# EAGLE design SulaMatik (EAGLE 6.4)
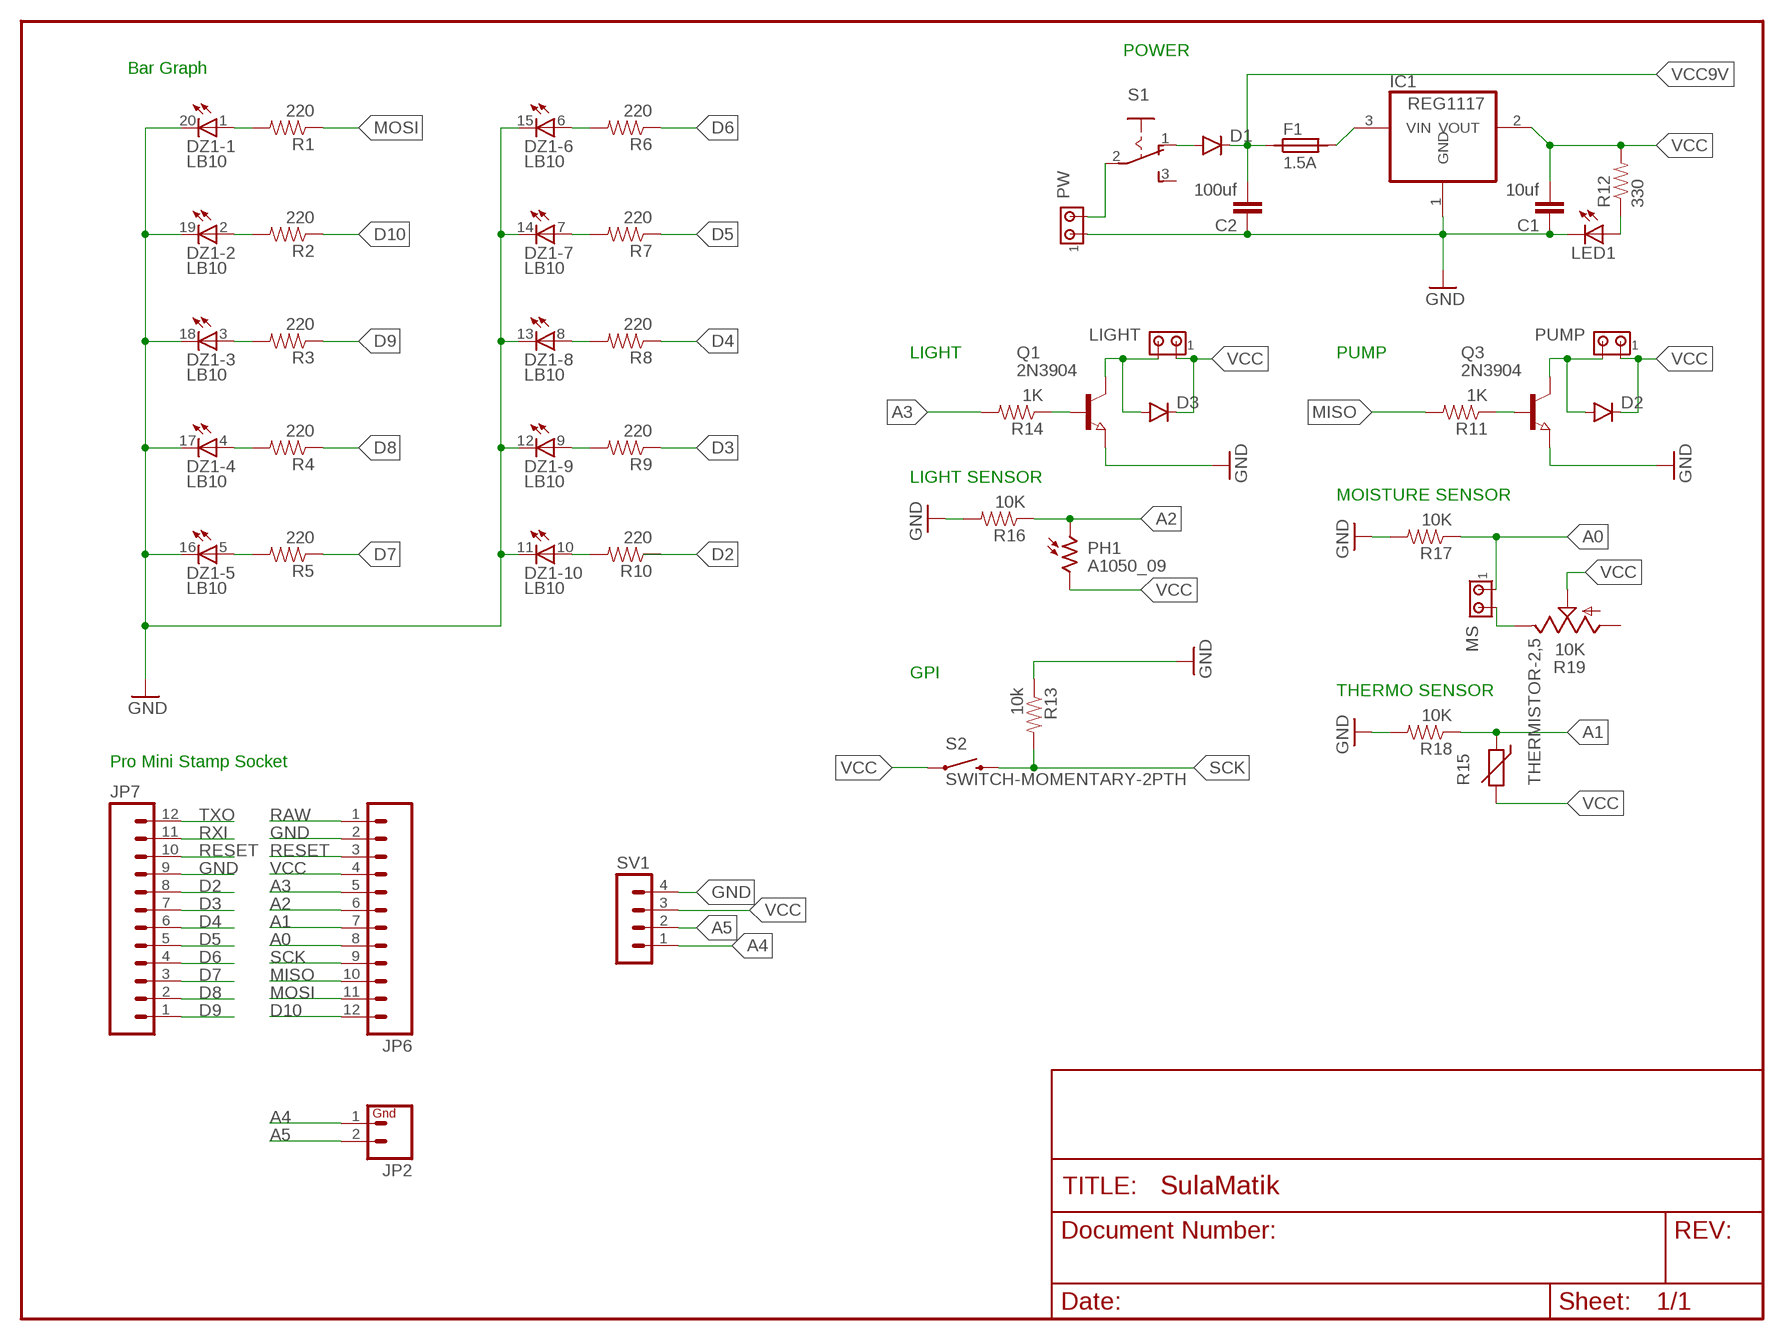
[diagram p0: schematic, sheet 1]

## Parts
C1  10uf  CAP0805  [0805]
C2  100uf  CAP0805  [0805]
D1  DIODESMA  [SMA-DIODE]
D2  DIODESMA  [SMA-DIODE]
D3  DIODESMA  [SMA-DIODE]
DZ1  LB10  [LB10]
F1  1.5A  SIBA194600  [1820]
IC1  REG1117  [SOT223]
JP2  M02PTH  [1X02]
JP6  M12PTH  [1X12]
JP7  M12PTH  [1X12]
LED1  LEDCHIP-LED0805  [CHIP-LED0805]
LIGHT  MTA02-156  [1X2MTA]
MS  MTA02-156  [1X2MTA]
PH1  A1050_09  [T0-46-A10XX]
PUMP  MTA02-156  [1X2MTA]
PW  MTA02-156  [1X2MTA]
Q1  2N3904  NPN-TRANSISTOR_SOT23  [SOT23]
Q3  2N3904  NPN-TRANSISTOR_SOT23  [SOT23]
R1  220  RESISTOR0805-RES  [0805]
R2  220  RESISTOR0805-RES  [0805]
R3  220  RESISTOR0805-RES  [0805]
R4  220  RESISTOR0805-RES  [0805]
R5  220  RESISTOR0805-RES  [0805]
R6  220  RESISTOR0805-RES  [0805]
R7  220  RESISTOR0805-RES  [0805]
R8  220  RESISTOR0805-RES  [0805]
R9  220  RESISTOR0805-RES  [0805]
R10  220  RESISTOR0805-RES  [0805]
R11  1K  RESISTOR0805-RES  [0805]
R12  330  RESISTOR0805-RES  [0805]
R13  10k  RESISTOR0805-RES  [0805]
R14  1K  RESISTOR0805-RES  [0805]
R15  THERMISTOR-2,5  [RS-2,5]
R16  10K  RESISTOR0805-RES  [0805]
R17  10K  RESISTOR0805-RES  [0805]
R18  10K  RESISTOR0805-RES  [0805]
R19  10K  TRIM_US-CA6V  [CA6V]
S1  255SB  [255SB]
S2  SWITCH-MOMENTARY-2PTH  [TACTILE-PTH]
SV1  MA04-1  [MA04-1]

## Nets
A0: JP6.8 MS.1 R17.1
A1: JP6.7 R15.1 R18.1
A2: JP6.6 PH1.1 R16.1
A3: JP6.5 R14.2
A4: JP2.1 SV1.1
A5: JP2.2 SV1.2
D2: JP7.8 R10.1
D3: JP7.7 R9.1
D4: JP7.6 R8.1
D5: JP7.5 R7.1
D6: JP7.4 R6.1
D7: JP7.3 R5.1
D8: JP7.2 R4.1
D9: JP7.1 R3.1
D10: JP6.12 R2.1
GND: C1.1 C2.1 DZ1.11(-10:C) DZ1.12(-9:C) DZ1.13(-8:C) DZ1.14(-7:C) DZ1.15(-6:C) DZ1.16(-5:C) DZ1.17(-4:C) DZ1.18(-3:C) DZ1.19(-2:C) DZ1.20(-1:C) IC1.1(GND) JP6.2 JP7.9 LED1.C PW.1 Q1.2(E) Q3.2(E) R13.1 R16.2 R17.2 R18.2 SV1.4
MISO: JP6.10 R11.2
MOSI: JP6.11 R1.1
N$1: F1.2 IC1.3(VIN)
N$2: PW.2 S1.2(P)
N$3: DZ1.5(-5:A) R5.2
N$4: DZ1.4(-4:A) R4.2
N$5: D2.A PUMP.2 Q3.3(C)
N$6: Q3.1(B) R11.1
N$7: DZ1.3(-3:A) R3.2
N$8: DZ1.2(-2:A) R2.2
N$9: DZ1.1(-1:A) R1.2
N$10: DZ1.6(-6:A) R6.2
N$11: LED1.A R12.1
N$12: DZ1.7(-7:A) R7.2
N$13: D1.A S1.1(O)
N$14: DZ1.8(-8:A) R8.2
N$15: DZ1.9(-9:A) R9.2
N$16: DZ1.10(-10:A) R10.2
N$17: MS.2 R19.E
N$19: D3.A LIGHT.2 Q1.3(C)
N$20: Q1.1(B) R14.1
RAW [v]: JP6.1
RESET: JP6.3 JP7.10
RXI: JP7.11
SCK: JP6.9 R13.2 S2.3
TXO: JP7.12
VCC: C1.2 D2.C D3.C IC1.2(VOUT) JP6.4 LIGHT.1 PH1.2 PUMP.1 R12.2 R15.2 R19.S S2.1 SV1.3
VCC9V: C2.2 D1.C F1.1
Unconnected: R19.A S1.3(S)

## Notes on the sheet
- POWER
- Bar Graph
- LIGHT | PUMP
- LIGHT SENSOR
- MOISTURE SENSOR
- GPI
- THERMO SENSOR
- Pro Mini Stamp Socket

## Library data of the parts
C1 C2 = SparkFun-Capacitors:CAP: Capacitor Standard 0603 ceramic capacitor, and 0.1" leaded capacitor.
D1-D3 = SparkFun-DiscreteSemi:DIODE: Diode These are standard reverse protection diodes and small signal diodes. SMA package can handle up to about 1A. SOD-323 can handle about 200mA. What the SOD-323 package when ordering, there are some mfgs out there that are 5-pin packages.
DZ1 = led:LB10: LED BLOCK 10-LED bar graph, DIL, Siemens
F1 = _hhn_PtcFuses_Siba_r500_Ozan:SIBA194600*: SIBA PTC-Fuses, Series 194600, 1812 (4.5 3.2)mm Source: www.siba.de/ Package: SMD 1812 (4.5 x 3.2)mm Technologies: SIBA194600Axxx xxx: Trip-Current * 10 mA Author: Dipl.-Ing. FH Rainer Bayer
IC1 = burr-brown:REG1117: 800mA and 1A Low Dropout (LDO) Positive Regulator 1.8V, 2.5V, 2.85V, 3.3V, 5V, and Adj; MPN: REG1117; OC_FARNELL: 1097566; OC_NEWARK: 14P6981
JP2 = SparkFun:M02: Header 2 Standard 2-pin 0.1" header. Use with straight break away headers (SKU : PRT-00116), right angle break away headers (PRT-00553), swiss pins (PRT-00743), machine pins (PRT-00117), and female headers (PRT-00115). Molex polarized connector foot print use with SKU : PRT-08233 with associated crimp pins and housings.
JP6 JP7 = SparkFun:M12: Header 12 Standard 12-pin 0.1" header. Use with straight break away headers (SKU : PRT-00116), right angle break away headers (PRT-00553), swiss pins (PRT-00743), machine pins (PRT-00117), and female headers (PRT-00115).
LED1 = led:LED: LED OSRAM: - CHIPLED LG R971, LG N971, LY N971, LG Q971, LY Q971, LO R971, LY R971 LH N974, LH R974 LS Q976, LO Q976, LY Q976 LO Q996 - Hyper CHIPLED LW Q18S LB Q993, LB Q99A, LB R99A - SideLED LS A670, LO A670, LY A670, LG A670, LP A670 LB A673, LV A673, LT A673, LW A673 LH A674 LY A675 LS A676, LA A676, LO A676, LY A676, LW A676 LS A679, LY A679, LG A679 - Hyper Micro SIDELED® LS Y876, LA Y876, LO Y876, LY Y876 LT Y87S - SmartLED LW L88C, LW L88S LB L89C, LB L89S, LG L890 LS L89K, LO L89K, LY L89K LS L896, LA L896, LO L896, LY L896 - TOPLED LS T670, LO T670, LY T670, LG T670, LP T670 LSG T670, LSP T670, LSY T670, LOP T670, LYG T670 LG T671, LOG T671, LSG T671 LB T673, LV T673, LT T673, LW T673 LH T674 LS T676, LA T676, LO T676, LY T676, LB T676, LH T676, LSB T676, LW T676 LB T67C, LV T67C, LT T67C, LS T67K, LO T67K, LY T67K, LW E67C LS E67B, LA E67B, LO E67B, LY E67B, LB E67C, LV E67C, LT E67C LW T67C LS T679, LY T679, LG T679 LS T770, LO T770, LY T770, LG T770, LP T770 LB T773, LV T773, LT T773, LW T773 LH T774 LS E675, LA E675, LY E675, LS T675 LS T776, LA T776, LO T776, LY T776, LB T776 LHGB T686 LT T68C, LB T68C - Hyper Mini TOPLED® LB M676 - Mini TOPLED Santana® LG M470 LS M47K, LO M47K, LY M47K Source: http://www.osram.convergy.de LUXEON: - LUMILED® LXK2-PW12-R00, LXK2-PW12-S00, LXK2-PW14-U00, LXK2-PW14-V00 LXK2-PM12-R00, LXK2-PM12-S00, LXK2-PM14-U00 LXK2-PE12-Q00, LXK2-PE12-R00, LXK2-PE12-S00, LXK2-PE14-T00, LXK2-PE14-U00 LXK2-PB12-K00, LXK2-PB12-L00, LXK2-PB12-M00, LXK2-PB14-N00, LXK2-PB14-P00, LXK2-PB14-Q00 LXK2-PR12-L00, LXK2-PR12-M00, LXK2-PR14-Q00, LXK2-PR14-R00 LXK2-PD12-Q00, LXK2-PD12-R00, LXK2-PD12-S00 LXK2-PH12-R00, LXK2-PH12-S00 LXK2-PL12-P00, LXK2-PL12-Q00, LXK2-PL12-R00 Source: www.luxeon.com KINGBRIGHT: KA-3528ASYC Source: www.kingbright.com
LIGHT MS PUMP PW = con-amp:MTA02-156: AMP connector
PH1 = photo-elements:A10: Sensor Robust Light Sensing Applications Outdoor Light Sensing Application Source: http://optoelectronics.perkinelmer.com/content/Datasheets/DTS_PhotocellsA1050.pdf
Q1 Q3 = semicon-smd-ipc:NPN-TRANSISTOR_: NPN TRANSISTOR
R1-R14 R16-R18 = SparkFun-Passives:RESISTOR: Resistor Basic schematic elements and footprints for 0603, 1206, and PTH resistors.
R15 = varistor:THERMISTOR: THERMISTOR
R19 = pot:TRIM_US-: POTENTIOMETER
S1 = switch:255SB: SLIDING SWITCH Distributor Buerklin, 11G810
S2 = SparkFun-Electromechanical:SWITCH-MOMENTARY-2: Various NO switches- pushbuttons, reed, etc
SV1 = con-lstb:MA04-1: PIN HEADER; OC_FARNELL: unknown; OC_NEWARK: unknown

## Net classes
0 default: width 0.3 mm, drill 0.5 mm, clearance 0.25 mm

## Board
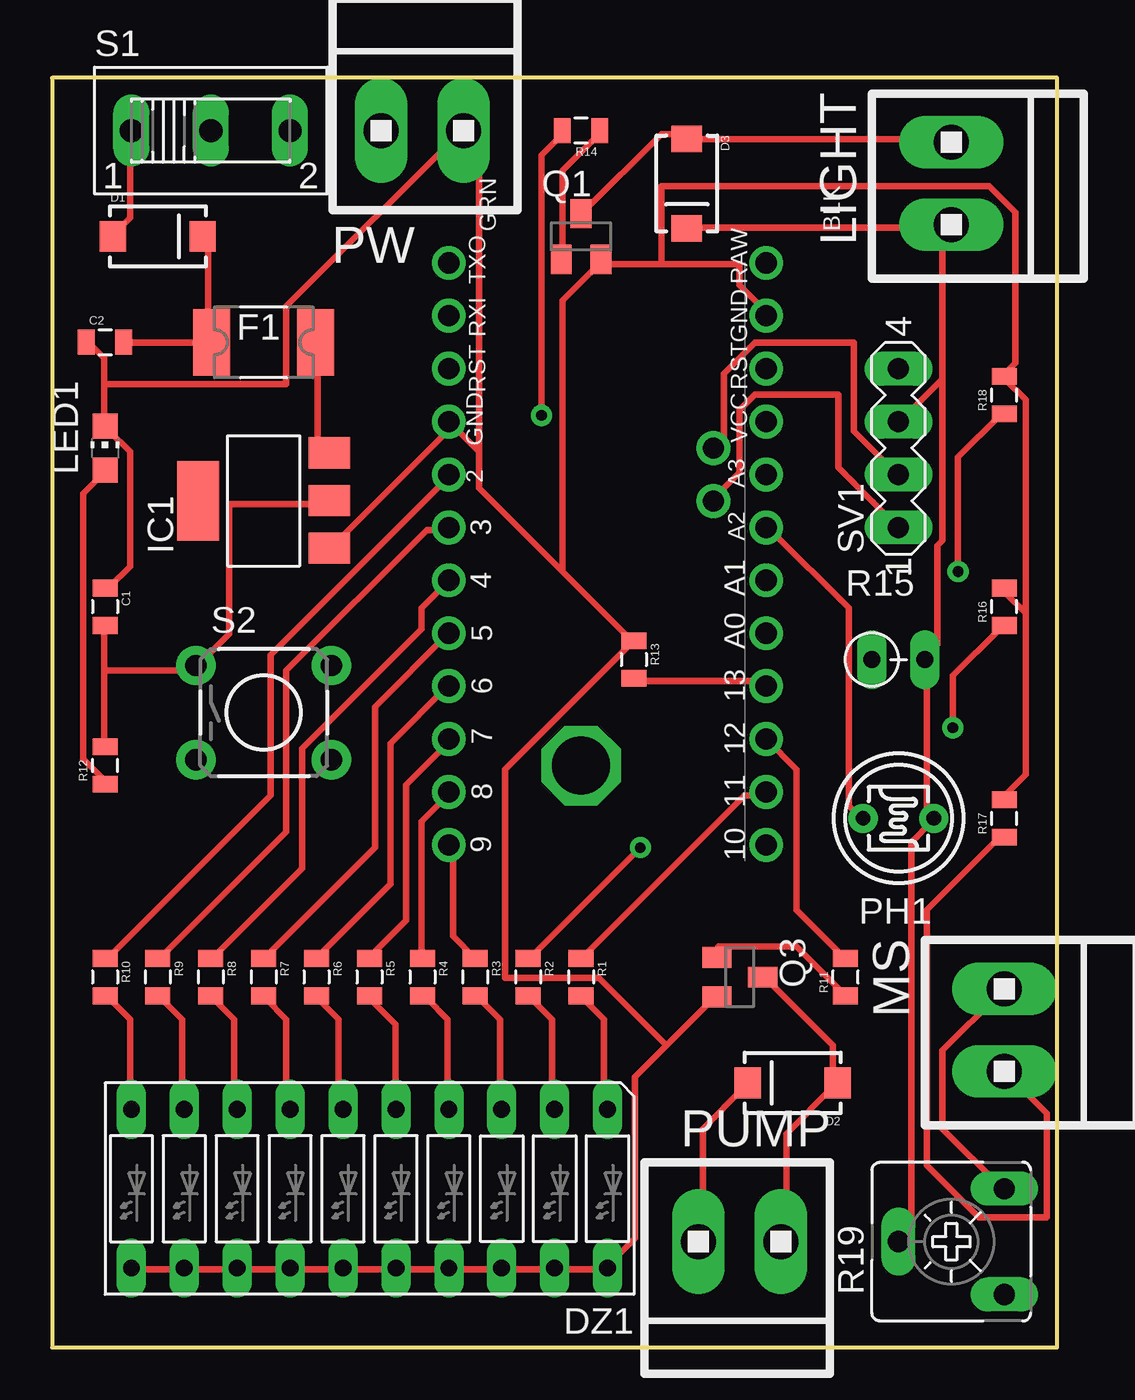
[diagram p1: board, top side]
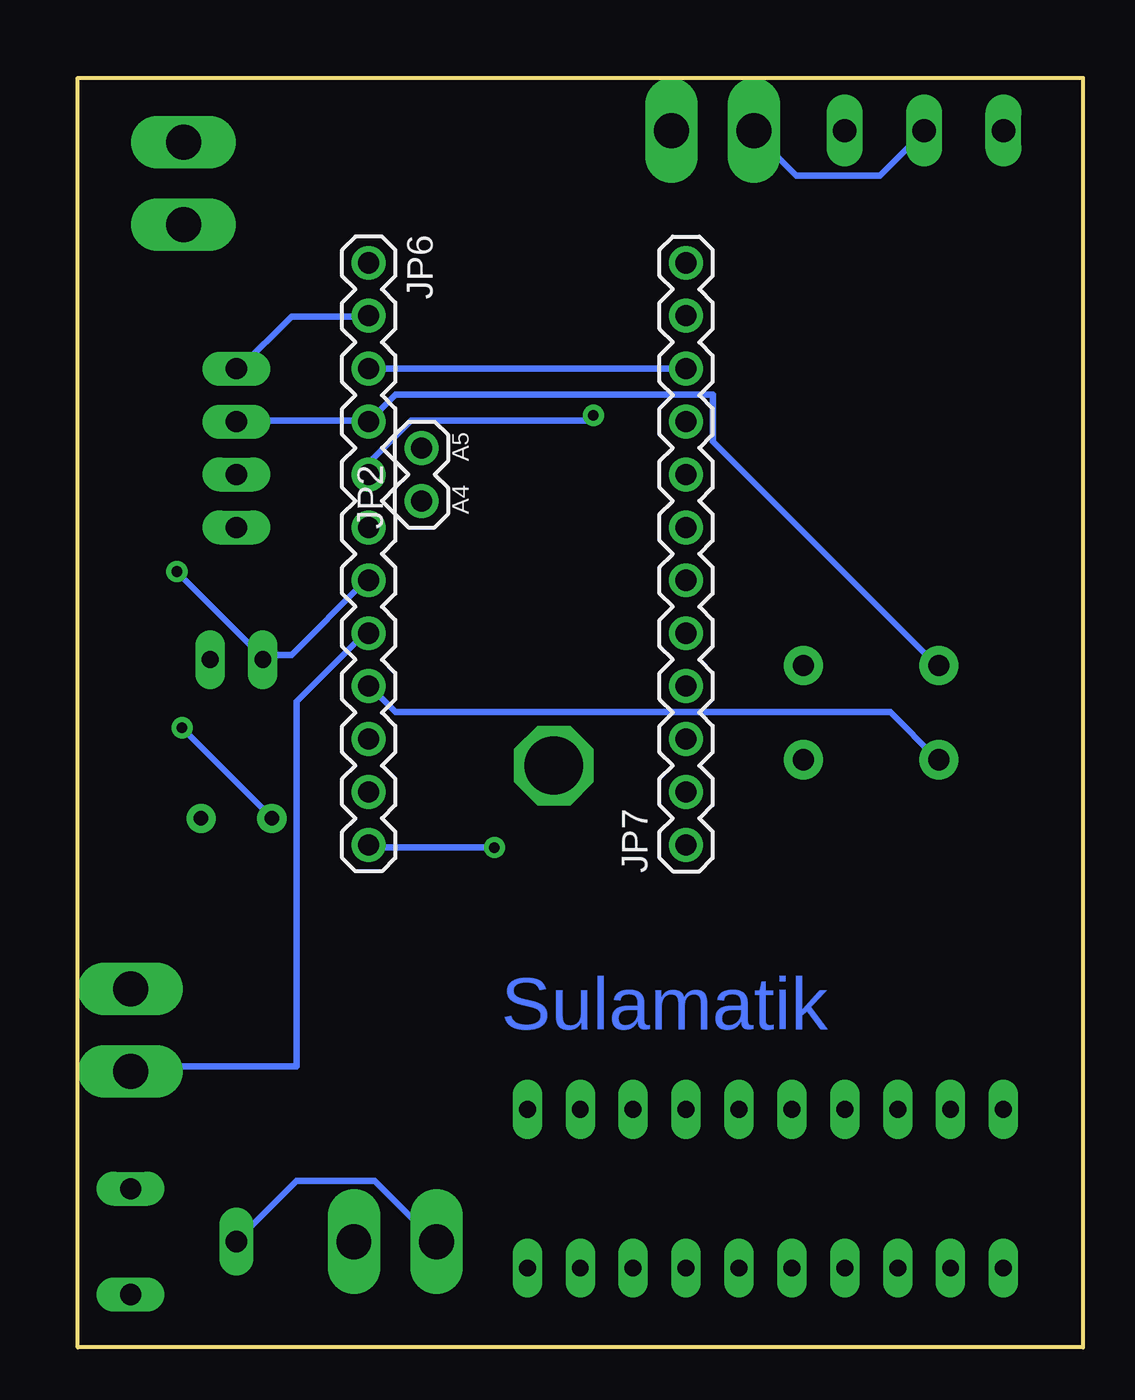
[diagram p2: board, bottom side, seen from below]

Size 48.26 x 60.96 mm. Coordinates in mm from the lower left corner, seen from the top.
Outline: 0,60.96 0,0 48.26,0 48.26,60.96 0,60.96
Copper layers (1*16): Top 0.035mm / dielectric 1.5mm / Bottom 0.035mm
Design rules "SparkFun *": minimum track width 8mil, minimum drill 20mil, track to track 8mil, track to pad 8mil, pad to pad 8mil, via to via 8mil, smd to smd 8mil, copper to edge 10mil, drill to drill 8mil, minimum pad ring 12mil, minimum via ring 10mil, stop-mask expansion 4mil, vias tented up to drill 20mil, thermal gap 10mil

### Footprints (pad centres in the part's own frame; a part is rotated, then mirrored left to right if it is on the bottom)
0805 = smd 0.8 x 1.2: 1 -0.9,0; 2 0.9,0
SMA-DIODE = smd 1.27 x 1.47: A -2.15,0; C 2.15,0
LB10 = drill 0.813 long: 1 -11.43,-3.81; 2 -8.89,-3.81; 3 -6.35,-3.81; 4 -3.81,-3.81; 5 -1.27,-3.81; 6 1.27,-3.81; 7 3.81,-3.81; 8 6.35,-3.81; 9 8.89,-3.81; 10 11.43,-3.81; 11 11.43,3.81; 12 8.89,3.81; 13 6.35,3.81; 14 3.81,3.81; 15 1.27,3.81; 16 -1.27,3.81; 17 -3.81,3.81; 18 -6.35,3.81; 19 -8.89,3.81; 20 -11.43,3.81
1820 = smd 1.78 x 3.2: 1 -2.49,0; 2 2.49,0
SOT223 = smd 1.499 x 2.007: 1 -2.261,-3.15; 2 0.025,-3.15; 3 2.311,-3.15 | smd 3.81 x 2.007: 4 0,3.15
1X02 = drill 1.016: 1 0,0; 2 2.54,0
1X12 = drill 1.016: 1 0,0; 2 2.54,0; 3 5.08,0; 4 7.62,0; 5 10.16,0; 6 12.7,0; 7 15.24,0; 8 17.78,0; 9 20.32,0; 10 22.86,0; 11 25.4,0; 12 27.94,0
CHIP-LED0805 = smd 1.2 x 1.2: A 0,-1.05; C 0,1.05
1X2MTA = drill 1.676 long: 1 1.981,0; 2 -1.981,0
T0-46-A10XX = drill 0.7 pad 1.4: 1 -1.7,0; 2 1.7,0
SOT23 = smd 1 x 1.4: 1 -0.95,-1.1; 2 0.95,-1.1; 3 0,1.1
RS-2,5 = drill 0.813 long: 1 -1.27,0; 2 1.27,0
CA6V = drill 1.016 long: A -2.54,-2.54; E 2.54,-2.54; S 0,2.54
255SB = drill 1.118 long: 1 -3.81,0; 2 0,0; 3 3.81,0
TACTILE-PTH = drill 1.016 pad 1.88: 1 -3.251,2.261; 2 3.251,2.261; 3 -3.251,-2.261; 4 3.251,-2.261
MA04-1 = drill 1.016 long: 1 -3.81,0; 2 -1.27,0; 3 1.27,0; 4 3.81,0

### Placement (x,y rotation side)
C1  2.54,35.56 270 top
C2  2.54,48.26 0 top
D1  5.08,53.34 0 top
D2  35.56,12.7 180 top
D3  30.48,55.88 270 top
DZ1  15.24,7.62 180 top
F1  10.16,48.26 0 top
IC1  10.16,40.64 90 top
JP2  31.75,40.64 90 bottom
JP6  34.29,52.07 270 bottom
JP7  19.05,24.13 90 bottom
LED1  2.54,43.18 0 top
LIGHT  43.18,55.88 270 top
MS  45.72,15.24 270 top
PH1  40.64,25.4 0 top
PUMP  33.02,5.08 180 top
PW  17.78,58.42 0 top
Q1  25.4,53.34 0 top
Q3  33.02,17.78 270 top
R1  25.4,17.78 270 top
R2  22.86,17.78 270 top
R3  20.32,17.78 270 top
R4  17.78,17.78 270 top
R5  15.24,17.78 270 top
R6  12.7,17.78 270 top
R7  10.16,17.78 270 top
R8  7.62,17.78 270 top
R9  5.08,17.78 270 top
R10  2.54,17.78 270 top
R11  38.1,17.78 90 top
R12  2.54,27.94 90 top
R13  27.94,33.02 270 top
R14  25.4,58.42 180 top
R15  40.64,33.02 0 top
R16  45.72,35.56 90 top
R17  45.72,25.4 90 top
R18  45.72,45.72 90 top
R19  43.18,5.08 90 top
S1  7.62,58.42 0 top
S2  10.16,30.48 0 top
SV1  40.64,43.18 90 top

### Tracks (layer width: path | path; a pad name or v marks a point on that pad's centre or on a via)
A0
  Top 0.3: R17.1 45.5,24.5 42,21 42,8.75 44.5,6.25 47.75,6.25 47.75,11.25 45.75,13.25 MS.1
  Bottom 0.3: JP6.8 34.5,34.25 37.75,31 37.75,13.5 45.5,13.5 MS.1
A1  (via drill 0.51)
  Top 0.3: v43.5,37.25 43.5,42.75 45.5,44.75 R18.1
  Bottom 0.3: v43.5,37.25 39.5,33.25 R15.1 39.25,33.25 38,33.25 34.5,36.75 JP6.7
A2  (via drill 0.51)
  Top 0.3: v43.25,29.75 43.25,32.25 45.5,34.5 R16.1 | JP6.6 34.5,39.25 38.25,35.5 38.25,26 38.75,25.5 PH1.1
  Bottom 0.3: v43.25,29.75 39,25.5 PH1.1
A3  (via drill 0.51)
  Top 0.3: v23.5,44.75 23.5,57.25 24.5,58.25 R14.2
  Bottom 0.3: v23.5,44.75 23.75,44.5 32.25,44.5 34.25,42.5 34.25,42 JP6.5
A4
  Top 0.3: JP2.1 31.75,40.75 33,42 33,45 33.75,45.75 37.75,45.75 37.75,42.25 40.5,39.5 SV1.1
A5
  Top 0.3: JP2.2 31.75,43.25 32.25,43.75 32.25,46.75 33.75,48.25 38.5,48.25 38.5,44 40.5,42 SV1.2
D2
  Top 0.3: R10.1 2.75,18.75 10.5,26.5 10.5,33.25 19,41.75 JP7.8
D3
  Top 0.3: R9.1 5.25,18.75 11.25,24.75 11.25,32.5 18,39.25 19,39.25 JP7.7
D4
  Top 0.3: R8.1 7.75,18.75 12,23 12,28.75 17.75,34.5 17.75,35.5 19,36.75 JP7.6
D5
  Top 0.3: R7.1 10.25,18.75 15.5,24 15.5,30.75 19,34.25 JP7.5
D6
  Top 0.3: R6.1 12.75,18.75 16.25,22.25 16.25,29 19,31.75 JP7.4
D7
  Top 0.3: R5.1 15.25,18.75 17,20.5 17,27 19,29 JP7.3
D8
  Top 0.3: R4.1 17.75,18.75 17.75,25.25 19,26.5 JP7.2
D9
  Top 0.3: R3.1 19.25,19.75 19.25,24 JP7.1
D10  (via drill 0.51)
  Top 0.3: v28.25,24 23,18.75 R2.1
  Bottom 0.3: v28.25,24 34.25,24 JP6.12
GND
  Top 0.3: 46.75,35.25 46.75,27.5 45.75,26.5 R17.2 | 46.75,35.25 45.75,36.25 R16.2 | 46.75,35.25 46.75,45.5 45.75,46.5 R18.2 45.75,46.75 46.25,47.25 46.25,54.5 45,55.75 29.25,55.75 29.25,52 | 29.25,52 33,52 33,51 34.25,49.75 JP6.2 | 29.25,52 26.5,52 Q1.2 26.25,52 24.5,50.25 24.5,37.25 | DZ1.11 4,3.75 6.25,3.75 DZ1.12 6.5,3.75 8.75,3.75 DZ1.13 9,3.75 11.25,3.75 DZ1.14 11.5,3.75 13.75,3.75 DZ1.15 14,3.75 16.5,3.75 DZ1.16 16.75,3.75 19,3.75 DZ1.17 19.25,3.75 21.5,3.75 DZ1.18 21.75,3.75 24,3.75 DZ1.19 24.25,3.75 26.5,3.75 DZ1.20 26.75,4 28,5.25 28,13 29.5,14.5 | 29.5,14.5 31.75,16.75 Q3.2 | C1.1 2.75,36.5 3.75,37.5 3.75,43 2.75,44 LED1.C 2.5,44.25 2.5,46.25 | 2.5,46.25 2.5,47.5 1.75,48.25 C2.1 | 24.5,37.25 20.5,41.25 20.5,43 | 24.5,37.25 27.75,34 R13.1 27.75,33.75 21.75,27.75 21.75,17.75 26.25,17.75 29.5,14.5 | 20.5,43 JP7.9 19,44.25 19,44 13.5,38.5 IC1.1 | 20.5,43 20.5,57.75 20,58.25 PW.1 19.75,58.5 11.25,50 11.25,46.25 2.5,46.25
  Bottom 0.3: SV1.4 40.5,47 38,49.5 34.5,49.5 JP6.2
MISO
  Top 0.3: JP6.10 35.75,27.75 35.75,21 38,18.75 R11.2
MOSI
  Top 0.3: R1.1 25.5,18.75 33.25,26.5 34.25,26.5 JP6.11
N$1
  Top 0.3: IC1.3 13.25,43 12.75,43.5 12.75,48.25 F1.2
N$2
  Bottom 0.3: S1.2 7.75,58.25 9.75,56.25 13.75,56.25 15.75,58.25 PW.2
N$3
  Top 0.3: R5.2 15.25,16.75 16.5,15.5 16.5,11.5 DZ1.5
N$4
  Top 0.3: R4.2 18,16.75 19,15.75 19,11.5 DZ1.4
N$5
  Top 0.3: Q3.3 34.25,17.75 37.5,14.5 37.5,12.75 D2.A 37.5,12.5 35.25,10.25 35.25,5.25 PUMP.2
N$6
  Top 0.3: R11.1 38,17 35.75,19.25 32,19.25 32,18.75 Q3.1
N$7
  Top 0.3: R3.2 20.5,16.75 21.5,15.75 21.5,11.5 DZ1.3
N$8
  Top 0.3: R2.2 23,16.75 24,15.75 24,11.5 DZ1.2
N$9
  Top 0.3: R1.2 25.5,16.75 26.5,15.75 26.5,11.5 DZ1.1
N$10
  Top 0.3: R6.2 12.75,16.75 13.75,15.75 13.75,11.5 DZ1.6
N$11
  Top 0.3: R12.1 2.5,27.25 1.5,28.25 1.5,41 2.5,42 LED1.A
N$12
  Top 0.3: R7.2 10.25,16.75 11.25,15.75 11.25,11.5 DZ1.7
N$13
  Top 0.3: D1.A 3,53.5 3.75,54.25 3.75,58.25 S1.1
N$14
  Top 0.3: R8.2 8.75,15.75 8.75,11.5 DZ1.8
N$15
  Top 0.3: R9.2 5.25,16.75 6.25,15.75 6.25,11.5 DZ1.9
N$16
  Top 0.3: R10.2 2.75,16.75 3.75,15.75 3.75,11.5 DZ1.10
N$17
  Top 0.3: R19.E 45.5,7.75 42.75,10.5 42.75,14.25 45.5,17 MS.2
N$18  (via drill 2.8)
  other vias: 25.4,27.94
N$19
  Top 0.3: Q1.3 25.5,54.5 29.25,58.25 30.25,58.25 D3.A 30.5,58 43,58 LIGHT.2
N$20
  Top 0.3: R14.1 26.25,58.25 24.5,56.5 24.5,52.25 Q1.1
RESET
  Bottom 0.3: JP7.10 19.25,47 34.25,47 JP6.3
SCK
  Top 0.3: R13.2 28,32 34.25,32 34.25,31.75 JP6.9
  Bottom 0.3: S2.3 7,28.25 9.25,30.5 33,30.5 34.25,31.75 JP6.9
VCC
  Top 0.3: D2.C 33.25,12.5 31.25,10.5 31.25,5.25 PUMP.1 | 2.5,32.5 2.5,34.5 C1.2 | 2.5,32.5 2.5,29 R12.2 | IC1.2 13.25,40.5 8.5,40.5 8.5,34.25 7,32.75 S2.1 6.75,32.5 2.5,32.5 | 42.75,53.75 43,53.75 LIGHT.1 42.75,53.75 | 42.75,53.75 30.5,53.75 D3.C | 42.75,46.5 40.75,44.5 SV1.3 | 42.75,53.75 42.75,46.5 | 42.75,46.5 42.75,38.75 42.5,38.5 42.5,33.75 42,33.25 R15.2 42,33 42,25.75 42.25,25.5 PH1.2 42.25,25.25 41.25,24.25 41.25,5.75 40.75,5.25 R19.S
  Bottom 0.3: R19.S 40.5,5.25 37.75,8 34,8 31.25,5.25 PUMP.1 | SV1.3 40.5,44.5 34.5,44.5 JP6.4 34.25,44.5 33,45.75 17.75,45.75 17.75,43.5 7,32.75 S2.1
VCC9V
  Top 0.3: C2.2 3.5,48.25 7.5,48.25 F1.1 7.5,48.5 7.5,53 7.25,53.25 D1.C

### Text on the board
Bottom: Sulamatik
tPlace: GRN | BLK | TXO | RAW | RXI | GND | RST | RST | GND | VCC | 2 | A3 | 3 | A2 | 4 | A1 | 5 | A0 | 6 | 13 | 7 | 12 | 8 | 11 | 9 | 10
bPlace: A5 | A4